# Altium schematic sheet XC888.SchDoc
size A4; SheetNumber: 4; SheetTotal: 6
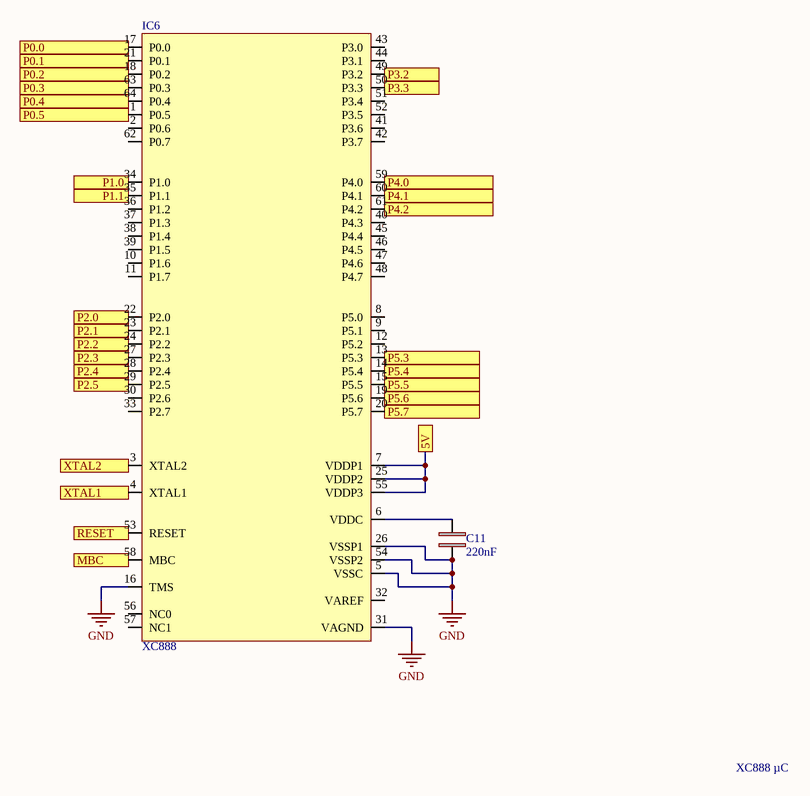
[diagram p0: XC888.SchDoc]

## Parts
C11  220nF  [C0805C224K5RACTU]
IC6  XC888  [XC888 - 3]

## Ports
5V, MBC, P0.0, P0.1, P0.2, P0.3, P0.4, P0.5, P1.0, P1.1, P2.0, P2.1, P2.2, P2.3, P2.4, P2.5, P3.2, P3.3, P4.0, P4.1, P4.2, P5.3, P5.4, P5.5, P5.6, P5.7, RESET, XTAL1, XTAL2

## Nets
GND: C11.2 IC6.5(VSSC) IC6.16(TMS) IC6.26(VSSP1) IC6.31(VAGND) IC6.54(VSSP2)
5V: IC6.7(VDDP1) IC6.25(VDDP2) IC6.55(VDDP3) ; port 5V
MBC: IC6.58(MBC) ; port MBC
P0.0: IC6.17(P0.0) ; port P0.0
P0.1: IC6.21(P0.1) ; port P0.1
P0.2: IC6.18(P0.2) ; port P0.2
P0.3: IC6.63(P0.3) ; port P0.3
P0.4: IC6.64(P0.4) ; port P0.4
P0.5: IC6.1(P0.5) ; port P0.5
P1.0: IC6.34(P1.0) ; port P1.0
P1.1: IC6.35(P1.1) ; port P1.1
P2.0: IC6.22(P2.0) ; port P2.0
P2.1: IC6.23(P2.1) ; port P2.1
P2.2: IC6.24(P2.2) ; port P2.2
P2.3: IC6.27(P2.3) ; port P2.3
P2.4: IC6.28(P2.4) ; port P2.4
P2.5: IC6.29(P2.5) ; port P2.5
P3.2: IC6.49(P3.2) ; port P3.2
P3.3: IC6.50(P3.3) ; port P3.3
P4.0: IC6.59(P4.0) ; port P4.0
P4.1: IC6.60(P4.1) ; port P4.1
P4.2: IC6.61(P4.2) ; port P4.2
P5.3: IC6.13(P5.3) ; port P5.3
P5.4: IC6.14(P5.4) ; port P5.4
P5.5: IC6.15(P5.5) ; port P5.5
P5.6: IC6.19(P5.6) ; port P5.6
P5.7: IC6.20(P5.7) ; port P5.7
RESET: IC6.53(RESET) ; port RESET
XTAL1: IC6.4(XTAL1) ; port XTAL1
XTAL2: IC6.3(XTAL2) ; port XTAL2
NetC11_1: C11.1 IC6.6(VDDC)

Not connected (* = marked no-connect by the designer): IC6 2(P0.6) 8(P5.0) 9(P5.1) 10(P1.6) 11(P1.7) 12(P5.2) 30(P2.6) 32(VAREF) 33(P2.7) 36(P1.2) 37(P1.3) 38(P1.4) 39(P1.5) 40(P4.3) 41(P3.6) 42(P3.7) 43(P3.0) 44(P3.1) 45(P4.4) 46(P4.5) 47(P4.6) 48(P4.7) 51(P3.4) 52(P3.5) 56(NC0) 57(NC1) 62(P0.7)

## Notes on the sheet
- XC888 µC

## Library data of the parts
C11 = C0805C224K5RACTU: 0805 C 220nF Ceramic Multilayer Capacitor; 50 VDC; +125degC; X7R Dielec; +/-10%; Manufacturer: KEMET; Voltage Rating: 50V; Tolerance: 10%; Dissipation Factor: 2.5%; Supplier 1: RSComponents; Manufacturer Part Number: C0805C224K5RACTU; RoHS: Yes; Category: Ceramic Capacitors; Stock 1: 18500; Pricing 1: 500=0,04800, 2500=0,03900 (USD); Mount: Surface Mount,PCB; Case/Package: 0805; Case Code (Metric): 2012; Case Code (Imperial): 0805; Dielectric Material: Ceramic; Min Operating Temperature: -55°C; Max Operating Temperature: 125°C; Package Quantity: 1; Capacitance: 220nF; Packaging: Tape and Reel; Voltage Rating (DC): 50V; Dielectric: X7R; Termination: SMD/SMT; Voltage: 50V; Series: C; Construction: Flat; Length: 2mm; Width: 0.049inch; Height: 1.1mm; Thickness: 0.055inch; Lead Pitch: 0.75mm; Depth: 1.25mm; Radiation Hardening: No; REACH SVHC: No SVHC; RoHS Compliant: Yes; ComponentLink1URL: https://datasheet.ciiva.com/7842/kem-c1002-x7r-smd-7842582.pdf?src-supplier=Element14; ComponentLink1Description: https://datasheet.ciiva.com/7842/kem-c1002-x7r-smd-7842582.pdf?src-supplier=Element14; ComponentLink2URL: https://datasheet.ciiva.com/18193/getdatasheetpartid-304413-18193686.pdf?src-supplier=Verical; ComponentLink2Description: https://datasheet.ciiva.com/18193/getdatasheetpartid-304413-18193686.pdf?src-supplier=Verical; Supplier Part Number 1: 8029927
IC6 = XC8888FFI5VACFXUMA1: MCU 8-Bit XC800 8051 CISC 32KB Flash 2.5V/5V 64-Pin LQFP T/R; Manufacturer: Infineon; RAM Size: 1.75KB; Number of Timers/Counters: 4; Max Supply Voltage: 5.5V; Min Supply Voltage: 2.3V; Interface: UART,USART,SPI; Data Bus Width: 8b; Number of Programmable I/O: 48; Watchdog Timer: Yes; Max Frequency: 24MHz; Operating Supply Voltage: 5V; Peripherals: Brown-out Detect/Reset,POR,PWM,WDT; Oscillator Type: Internal; Core Architecture: 8051; Supplier 1: Digi-Key; Manufacturer Part Number: XC8888FFI5VACFXUMA1; RoHS: Yes; Category: Microcontrollers; Pricing 1: 1900=2,88420 (USD); Case/Package: TQFP; Number of Pins: 64; Min Operating Temperature: -40°C; Max Operating Temperature: 85°C; Packaging: Tape and Reel; Memory Type: FLASH; Memory Size: 32KB; Package Quantity: 1900; Series: XC8xx; Halogen Free: Halogen Free; RoHS Compliant: Yes; ComponentLink1URL: https://www.verical.com/server-webapp/html/getDatasheet?partID=753198&src-supplier=Verical; ComponentLink1Description: https://www.verical.com/server-webapp/html/getDatasheet?partID=753198&src-supplier=Verical; ComponentLink2URL: http://components.arrow.com/part/dataview/0323_00171966?src-supplier=Arrow+Europe; ComponentLink2Description: http://components.arrow.com/part/dataview/0323_00171966?src-supplier=Arrow+Europe; ComponentLink3URL: http://components.arrow.com/part/dataview/52118966S8474747N2051?src-supplier=Arrow+Electronics; ComponentLink3Description: http://components.arrow.com/part/dataview/52118966S8474747N2051?src-supplier=Arrow+Electronics; ComponentLink4URL: https://www.infineon.com/dgdl/Infineon-XC88XCLM-DS-v01_02-en.pdf?fileId=db3a304412b407950112b40c4a9e0afb&src-supplier=Digi-Key; ComponentLink4Description: https://www.infineon.com/dgdl/Infineon-XC88XCLM-DS-v01_02-en.pdf?fileId=db3a304412b407950112b40c4a9e0afb&src-supplier=Digi-Key; ComponentLink5URL: http://www.infineon.com/dgdl/Infineon-XC88XCLM-DS-v01_02-en.pdf?fileId=db3a304412b407950112b40c4a9e0afb&ack=t&src-supplier=Avnet+Europe; ComponentLink5Description: http://www.infineon.com/dgdl/Infineon-XC88XCLM-DS-v01_02-en.pdf?fileId=db3a304412b407950112b40c4a9e0afb&ack=t&src-supplier=Avnet+Europe; ComponentLink6URL: http://www.infineon.com/dgdl/Infineon-XC88XCLM-DS-v01_02-en.pdf?fileId=db3a304412b407950112b40c4a9e0afb&ack=t&src-supplier=Avnet; ComponentLink6Description: http://www.infineon.com/dgdl/Infineon-XC88XCLM-DS-v01_02-en.pdf?fileId=db3a304412b407950112b40c4a9e0afb&ack=t&src-supplier=Avnet; Supplier Part Number 1: XC8888FFI5VACFXUMA1TR-ND